# EAGLE design SNAC  7ch SNES in Housing - Compact (EAGLE 9.0.1)
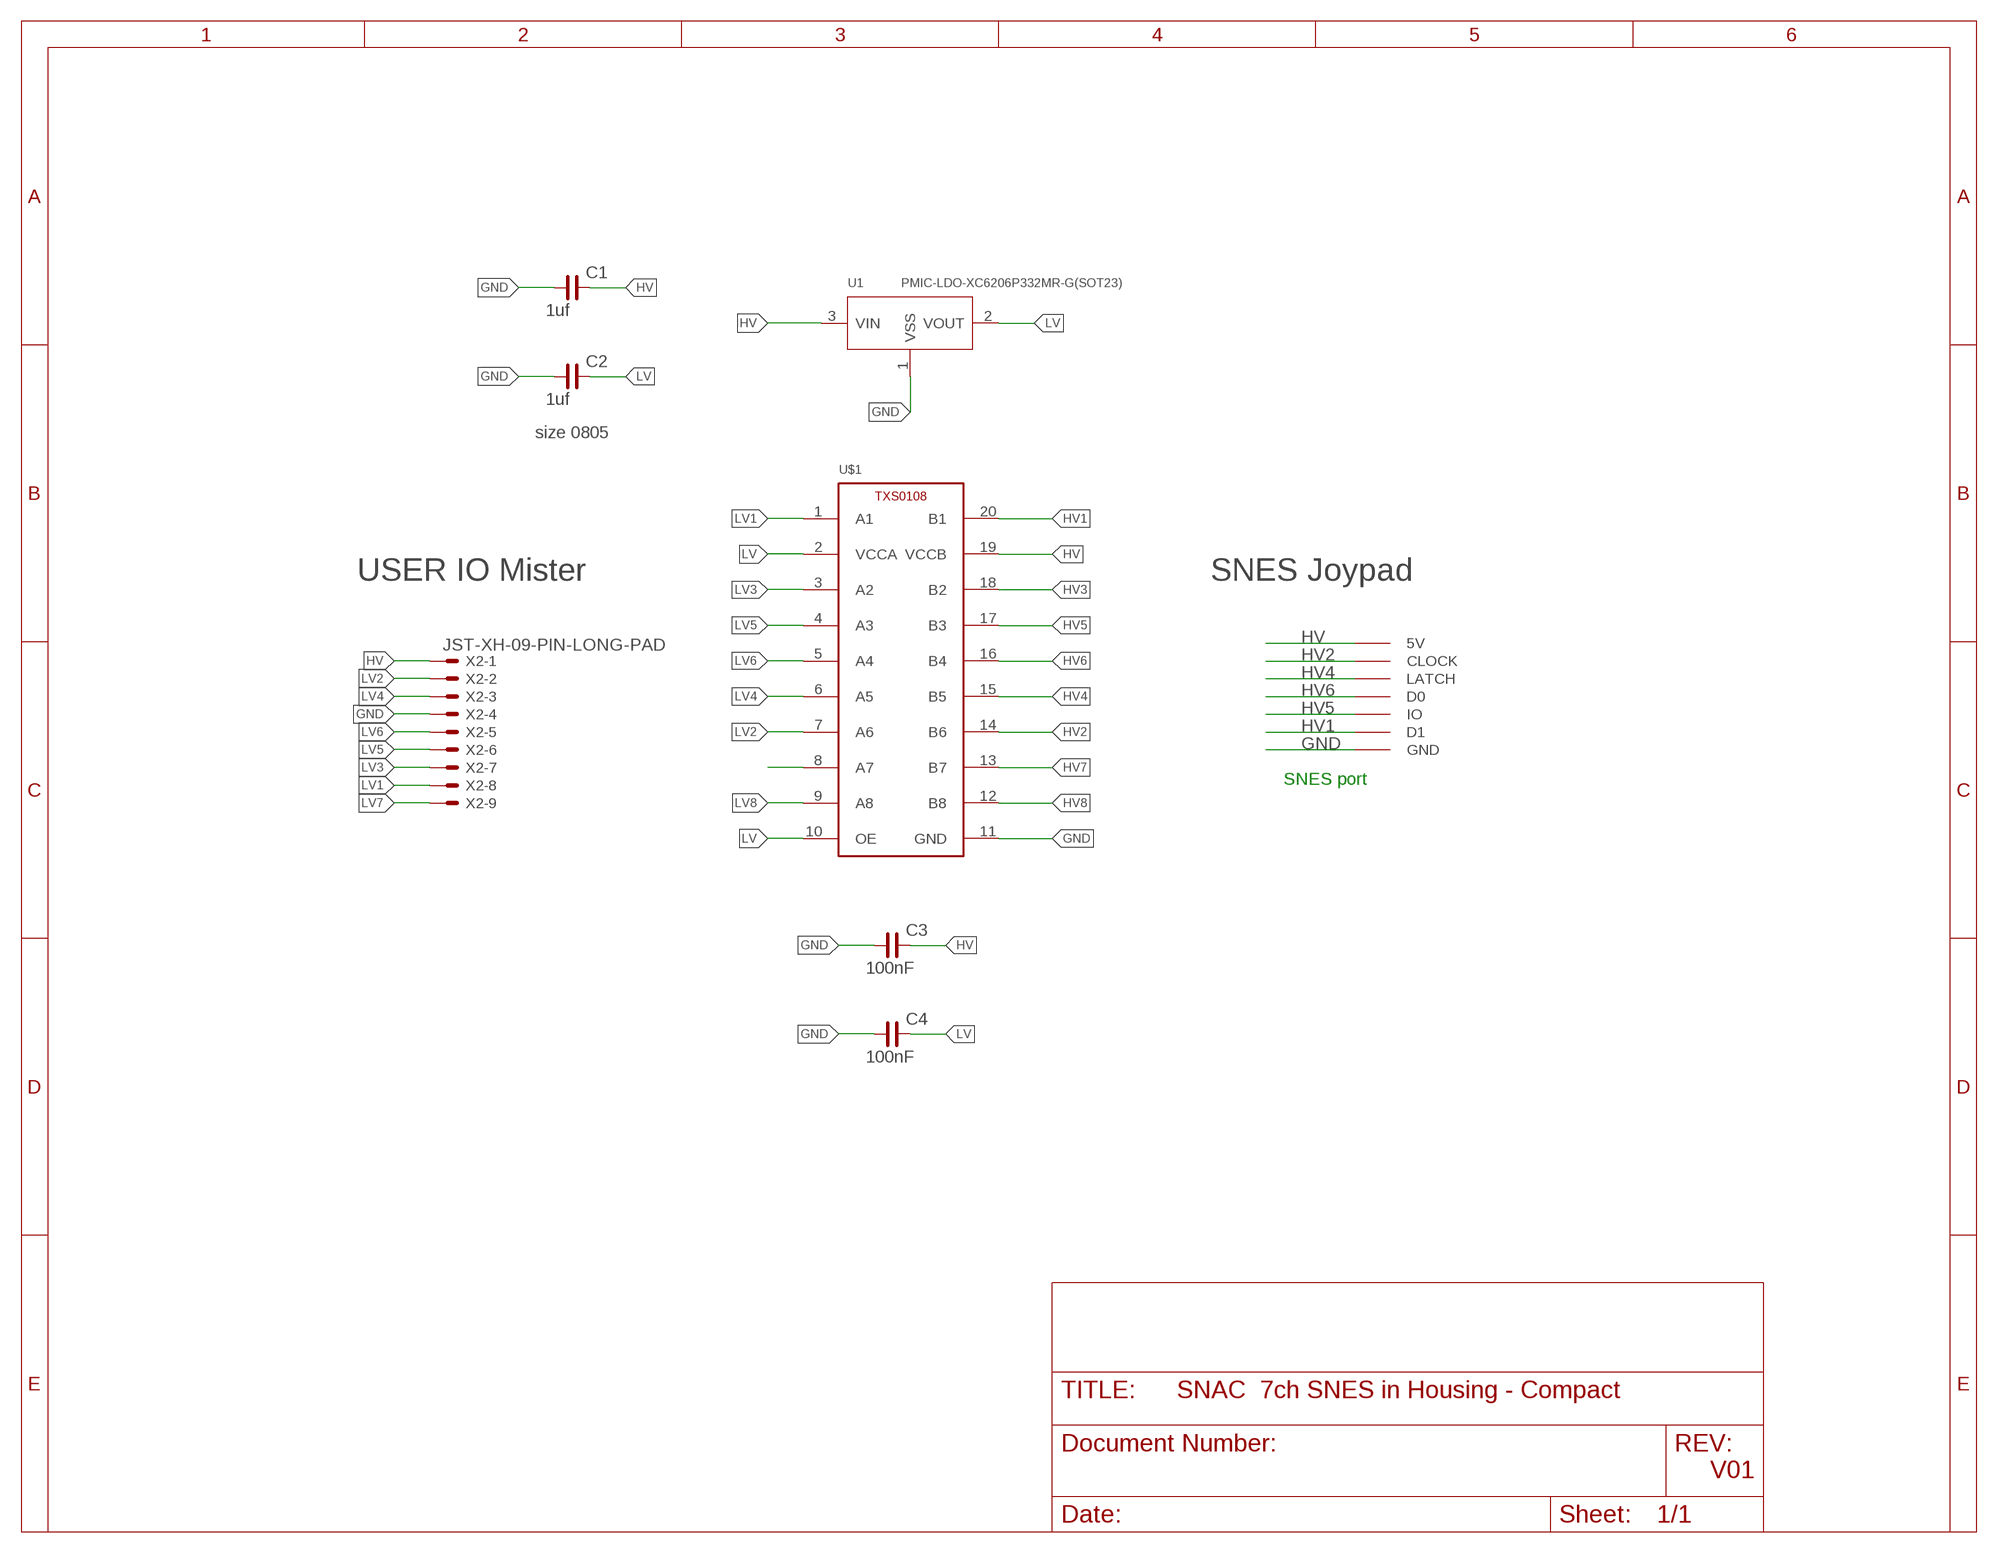
[diagram p0: schematic, sheet 1]

## Parts
C1  1uf  C_0805  [C0805]
C2  1uf  C_0805  [C0805]
C3  100nF  C_0805  [C0805]
C4  100nF  C_0805  [C0805]
U1  PMIC-LDO-XC6206P332MR-G(SOT23)  [SOT-23]
U$1  TXS0108  [R-PUSON-N20]
U$3  SNESCONN  [SNESCONN]
X2  JST-XH-09-PIN-LONG-PAD  [JST-XH-09-PACKAGE-LONG-PAD]

## Nets
GND: C1.1 C2.1 C3.1 C4.1 U1.1(VSS) U$1.11(GND) U$3.GND X2.4
HV: C1.2 C3.2 U1.3(VIN) U$1.19(VCCB) U$3.5V X2.1
HV1: U$1.20(B1) U$3.D1
HV2: U$1.14(B6) U$3.CLOCK
HV3: U$1.18(B2)
HV4: U$1.15(B5) U$3.LATCH
HV5: U$1.17(B3) U$3.IO
HV6: U$1.16(B4) U$3.D0
HV7: U$1.13(B7)
HV8: U$1.12(B8)
LV: C2.2 C4.2 U1.2(VOUT) U$1.2(VCCA) U$1.10(OE)
LV1: U$1.1(A1) X2.8
LV2: U$1.7(A6) X2.2
LV3: U$1.3(A2) X2.7
LV4: U$1.6(A5) X2.3
LV5: U$1.4(A3) X2.6
LV6: U$1.5(A4) X2.5
LV7: X2.9
LV8: U$1.9(A8)
N$6: U$1.8(A7)

## Notes on the sheet
- size 0805
- USER IO Mister | SNES Joypad
- SNES port
- V01

## Library data of the parts
C1-C4 = rc-master-smd:C_: NON-POLARIZED CAP
U1 = PMIC-LDO-XC6206P332MR-G_SOT23_:PMIC-LDO-XC6206P332MR-G(SOT23): 310030099; AVAILABILITY: Unavailable; DESCRIPTION: SMD PMIC; LDO; Vin 6V; 3.3V; 200mA; Without En; 1-Ch; MF: Torex; MP: XC6206P332MR-G; PACKAGE: SOT-23-3 Torex; PRICE: None
U$1 = FaBo-LevelTranslator:TXS0108
U$3 = gamepad-conn:SNESCONN
X2 = Rembrandt Electronics - JST XH Connectors v1-0:JST-XH-09-PIN: JST XH Connector 2 Pin Wire to board connector. Pitch: 2,54 mm, (0.100") Number of pins: 9 Created by Rembrandt Electronics www.rembrandtelectronics.com

## Board
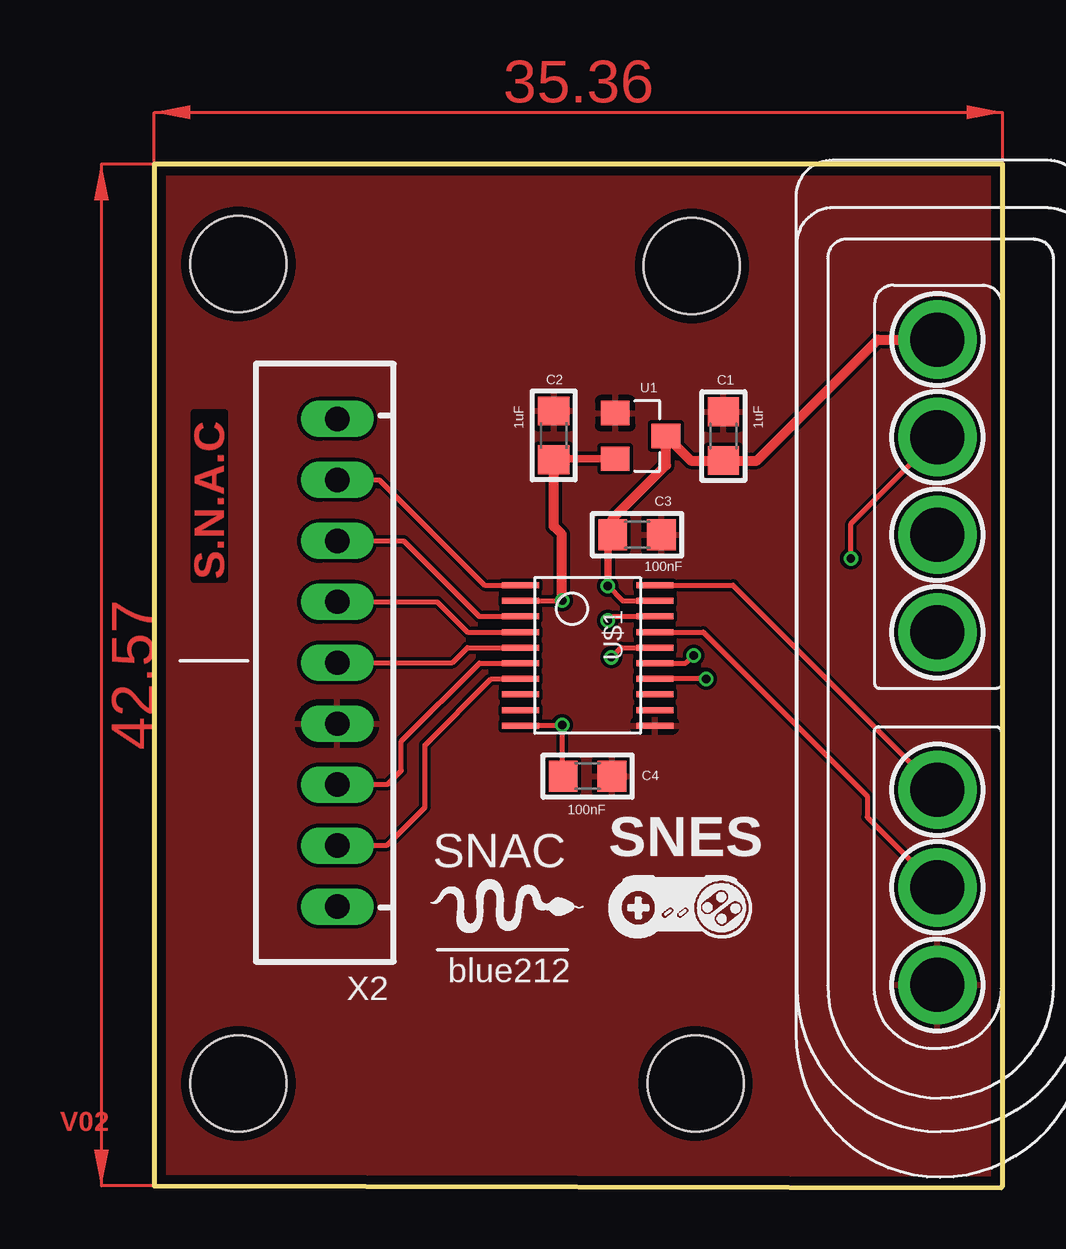
[diagram p1: board, top side]
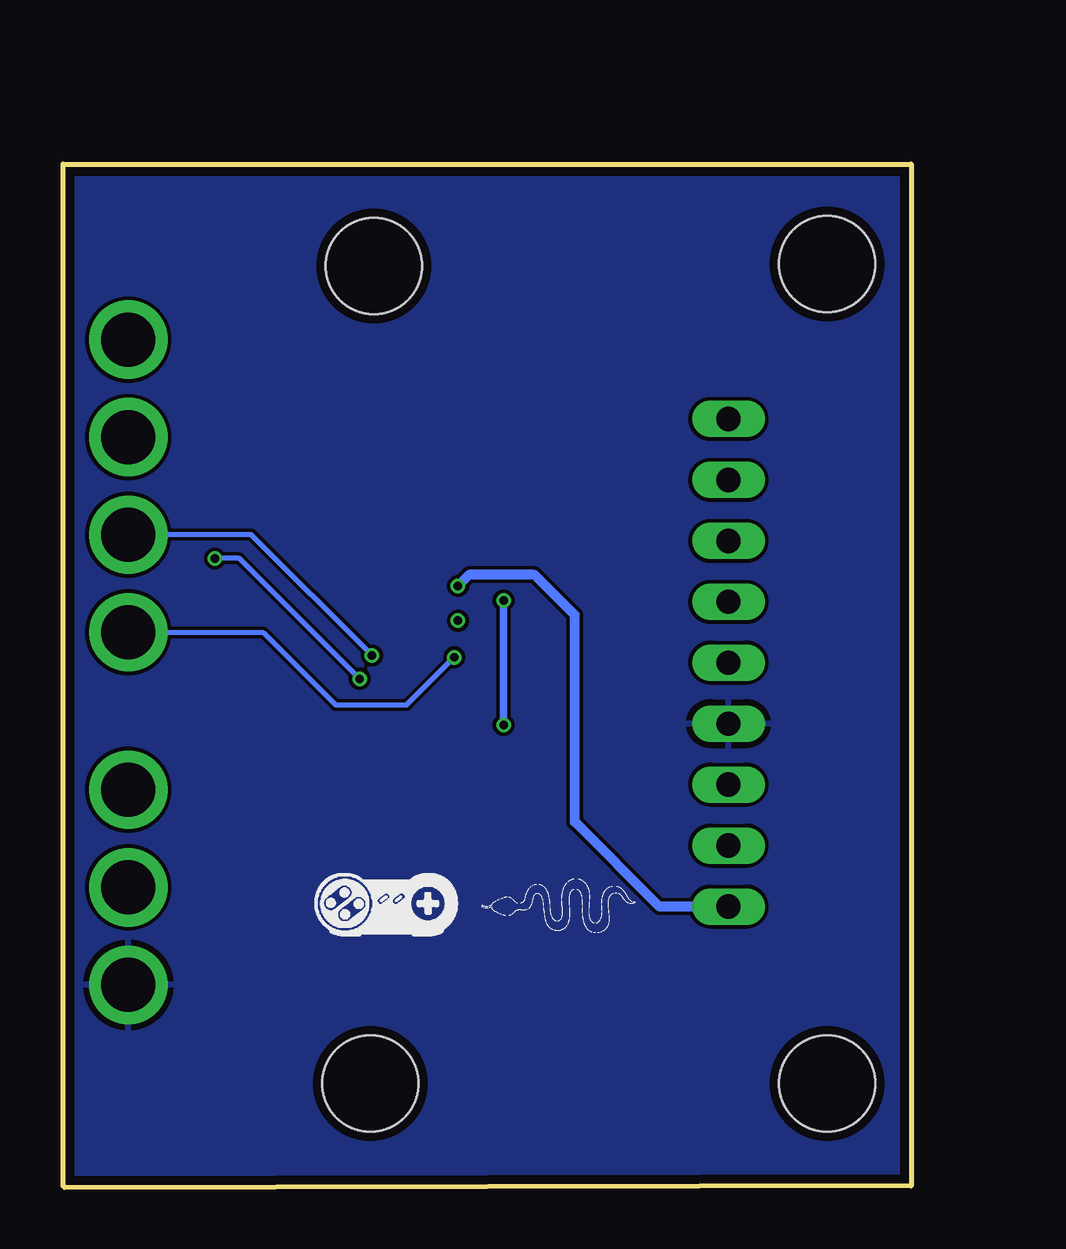
[diagram p2: board, bottom side, seen from below]

Size 35.36 x 42.65 mm. Coordinates in mm from the lower left corner, seen from the top.
Outline: 0,42.65 0,0.08 35.31,0 35.31,0.05 35.36,0.08 35.36,42.65 0,42.65
Copper layers (1*16): Top 0.035559375mm / dielectric 1.6mm / Bottom 0.035559375mm
Design rules "oshpark-2layer": minimum track width 6mil, minimum drill 10mil, track to track 6mil, track to pad 6mil, pad to pad 6mil, via to via 6mil, smd to smd 6mil, copper to edge 15mil, drill to drill 6mil, minimum pad ring 5mil, minimum via ring 5mil, stop-mask expansion 2.5mil, vias tented up to drill 0mil, thermal gap 10mil
Holes 4 mm at 3.51,38.48 22.4,38.4 3.51,4.34 22.56,4.34

### Footprints (pad centres in the part's own frame; a part is rotated, then mirrored left to right if it is on the bottom)
C0805 = smd 1.2 x 1.3: 1 -1.016,0; 2 1.016,0
SOT-23 = smd 1.016 x 1.2: 1 -0.95,-1.06; 2 0.95,-1.06; 3 0,1.06
R-PUSON-N20 = smd 0.25 x 1.55: 1 -2.925,-2.8; 2 -2.275,-2.8; 3 -1.625,-2.8; 4 -0.975,-2.8; 5 -0.325,-2.8; 6 0.325,-2.8; 7 0.975,-2.8; 8 1.625,-2.8; 9 2.275,-2.8; 10 2.925,-2.8; 11 2.925,2.8; 12 2.275,2.8; 13 1.625,2.8; 14 0.975,2.8; 15 0.325,2.8; 16 -0.325,2.8; 17 -0.975,2.8; 18 -1.625,2.8; 19 -2.275,2.8; 20 -2.925,2.8
SNESCONN = drill 2.25 pad 3.25: 5V 0,4.064; CLOCK 4.064,4.064; D0 12.192,4.064; D1 18.756,4.064; GND 26.884,4.064; IO 22.82,4.064; LATCH 8.128,4.064
JST-XH-09-PACKAGE-LONG-PAD = drill 1.016 long: 1 -10.16,0; 2 -7.62,0; 3 -5.08,0; 4 -2.54,0; 5 0,0; 6 2.54,0; 7 5.08,0; 8 7.62,0; 9 10.16,0

### Placement (x,y rotation side)
C1  23.72,31.31 270 top
C2  16.65,31.34 270 top
C3  20.12,27.2 180 top
C4  18.06,17.14 180 top
U1  20.27,31.32 270 top
U$1  18.06,22.17 270 top
U$3  28.57,35.33 270 top
X2  7.62,21.87 90 top

### Tracks (layer width: path | path; a pad name or v marks a point on that pad's centre or on a via)
GND
  pour Top: 35.23,42.6 35.28,42.6 35.36,34.29 35.36,0.1 0.03,0.13 0.08,42.57
  pour Bottom: 35.28,42.6 35.36,34.29 35.36,0.05 0.03,0.13 0.08,42.6
HV  (via drill 0.35)
  Top 0.203: v18.9,25.07 19.52,24.45 U$1.19
  Top 0.305: C3.2 18.9,27 v18.9,25.07
  Top 0.406: U1.3 22.36,30.29 C1.2 25.11,30.29 30.15,35.33 U$3.5V | 21.18,31.17 U1.3 | C3.2 19.1,27.86 21.33,30.09 U1.3
  Bottom 0.406: X2.1 10.49,11.71 14.02,15.24 14.02,23.85 15.7,25.53 18.44,25.53 v18.9,25.07
HV1
  Top 0.203: U$3.D1 24.12,25.1 U$1.20
HV2  (via drill 0.35)
  Top 0.203: v23,21.2 U$1.14 | v29.03,26.21 29.03,27.66 U$3.CLOCK
  Bottom 0.203: v23,21.2 28.01,26.21 v29.03,26.21
HV3  (via drill 0.35)
  Top 0.203: v18.9,23.62 19.07,23.8 U$1.18
HV4  (via drill 0.35)
  Top 0.203: U$1.15 22.15,21.85 v22.48,22.17
  Bottom 0.203: v22.48,22.17 27.51,27.2 U$3.LATCH
HV5
  Top 0.203: U$1.17 22.88,23.15 29.72,16.31 29.72,15.43 U$3.IO
HV6  (via drill 0.35)
  Top 0.203: v19.05,22.1 19.45,22.5 U$1.16
  Bottom 0.203: U$3.D0 27.03,23.14 24,20.12 21.03,20.12 v19.05,22.1
LV  (via drill 0.35)
  Top 0.203: U$1.2 16.98,24.45 v16.99,24.46 | U$1.10 16.96,19.25 v16.99,19.28 16.99,17.2 C4.2
  Top 0.305: U1.2 16.69,30.37 C2.2
  Top 0.406: 16.98,24.45 16.98,27.21 16.65,27.55 C2.2
  Bottom 0.305: v16.99,24.46 v16.99,19.28
LV1
  Top 0.203: X2.8 9.37,29.49 13.76,25.1 U$1.1
LV2
  Top 0.203: X2.2 9.68,14.25 11.28,15.85 11.28,18.44 14.04,21.2 U$1.7
LV3
  Top 0.203: U$1.3 13.54,23.8 10.39,26.95 X2.7
LV4
  Top 0.203: X2.3 9.7,16.79 10.29,17.37 10.29,18.59 13.54,21.85 U$1.6
LV5
  Top 0.203: U$1.4 13.05,23.15 11.79,24.41 X2.6
LV6
  Top 0.203: 7.64,21.85 X2.5 12.42,21.87 13.05,22.5 U$1.5
(copper drawn outside any net)
  shapes: Top area x2

### Text on the board
Top: S.N.A.C | V02
tPlace: 1uF | 1uF | 100nF | 100nF | SNAC | SNES | blue212
tValues: + | - | + | -